# EAGLE design CoaxBoard (EAGLE 9.5.2)
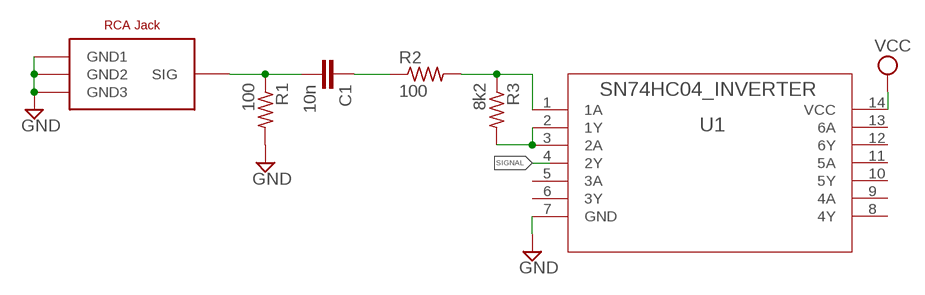
[diagram p0: schematic, sheet 1]

## Parts
C1  10n  C-EUC0805  [C0805]
R1  100  R-US_R0805  [R0805]
R2  100  R-US_R0805  [R0805]
R3  8k2  R-US_R0805  [R0805]
U1  SN74HC04_INVERTER  [NS14]
U$1  RCA_JACK  [RCA_JACK]

## Nets
GND: R1.2 U1.7(GND) U$1.GND1 U$1.GND2 U$1.GND3
N$1: C1.2 R1.1 U$1.SIG
N$2: C1.1 R2.1
N$3: R2.2 R3.1 U1.1(1A)
N$6: R3.2 U1.2(1Y) U1.3(2A)
SIGNAL: U1.4(2Y)
VCC: U1.14(VCC)
Unconnected: U1.5(3A) U1.6(3Y) U1.8(4Y) U1.9(4A) U1.10(5Y) U1.11(5A) U1.12(6Y) U1.13(6A)

## Library data of the parts
C1 = rcl:C-EU: CAPACITOR, European symbol; SPICEPREFIX: C
R1-R3 = resistor:R-US_: RESISTOR, American symbol
U1 = COAX_SPDIF:SN74HC04_INVERTER; DATASHEET_URL: http://www.ti.com/lit/gpn/SN74HC04; DESCRIPTION: Hex Inverters; FAMILY_NAME: INVERTING BUFFER/DRIVER; GENERIC_PART_NUMBER: SN74HC04; INDUSTRY_STD_PKG_TYPE: SO; MANUFACTURER: Texas Instruments; PACKAGE_DESIGNATOR: NS; PIN_COUNT: 14
U$1 = COAX_SPDIF:RCA_JACK

## Net classes
0 default: width 0.508 mm

## Board
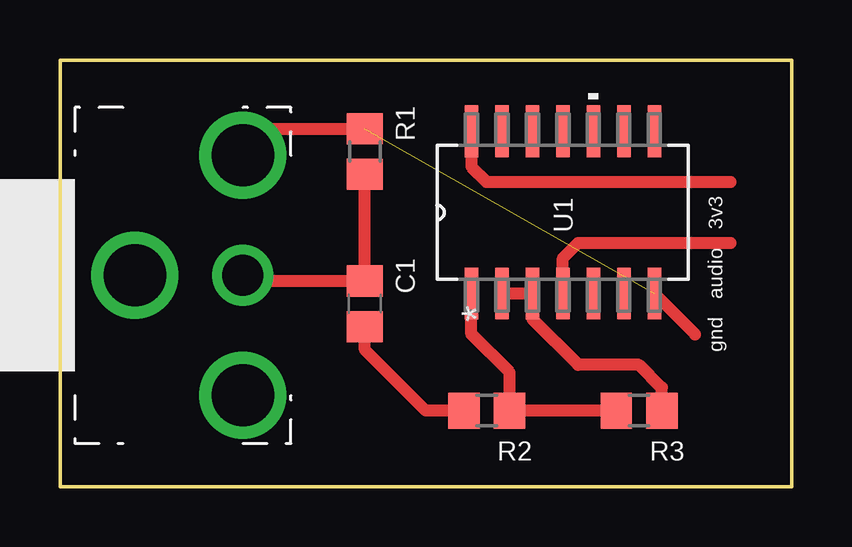
[diagram p1: board, top side]
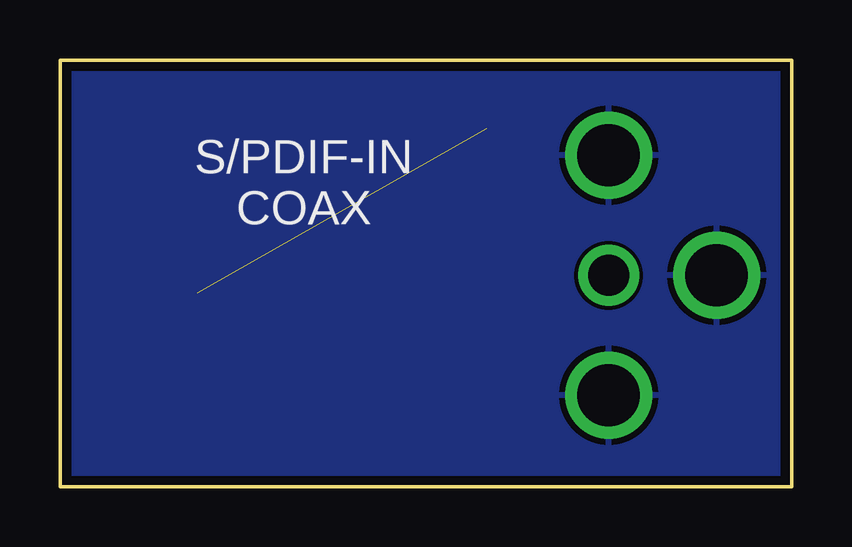
[diagram p2: board, bottom side, seen from below]

Size 30.48 x 17.78 mm. Coordinates in mm from the lower left corner, seen from the top.
Outline: 0,0 0,17.78 30.48,17.78 30.48,0 0,0
Copper layers (1*16): Top 0.035559375mm / dielectric 1.6mm / Bottom 0.035559375mm
Design rules "oshpark-2layer *": minimum track width 6mil, minimum drill 10mil, track to track 6mil, track to pad 6mil, pad to pad 6mil, via to via 6mil, smd to smd 6mil, copper to edge 15mil, drill to drill 6mil, minimum pad ring 5mil, minimum via ring 5mil, stop-mask expansion 2.5mil, vias tented up to drill 20mil, thermal gap 10mil

### Footprints (pad centres in the part's own frame; a part is rotated, then mirrored left to right if it is on the bottom)
C0805 = smd 1.3 x 1.5: 1 -0.95,0; 2 0.95,0
R0805 = smd 1.3 x 1.5: 1 -0.95,0; 2 0.95,0
NS14 = smd 2.159 x 0.559: 1 -3.378,3.81; 2 -3.378,2.54; 3 -3.378,1.27; 4 -3.378,0; 5 -3.378,-1.27; 6 -3.378,-2.54; 7 -3.378,-3.81; 8 3.378,-3.81; 9 3.378,-2.54; 10 3.378,-1.27; 11 3.378,0; 12 3.378,1.27; 13 3.378,2.54; 14 3.378,3.81
RCA_JACK = drill 2.6: GND1 0,0; GND2 5,4.5; GND3 10,0 | drill 1.7: SIG 5,0

### Placement (x,y rotation side)
C1  12.7,7.62 90 top
R1  12.7,13.97 90 top
R2  17.78,3.17 0 top
R3  24.13,3.17 0 top
U1  20.95,11.43 90 top
U$1  7.62,3.81 90 top

### Tracks (layer width: path | path; a pad name or v marks a point on that pad's centre or on a via)
GND  (1 unrouted)
  Top 0.508: U$1.GND3 8.73,14.92 R1.2 | U1.7 26.47,6.35
  pour Bottom: -1.27,24.13 -1.27,-2.54 33.02,-2.54 33.02,24.13
N$1
  Top 0.508: U$1.SIG 7.86,8.57 C1.2 R1.1
N$2
  Top 0.508: R2.1 15.24,3.17 12.7,5.71 C1.1
N$3
  Top 0.508: R3.1 R2.2 18.73,4.76 17.14,6.35 U1.1
N$6
  Top 0.508: U1.2 U1.3 19.68,6.99 21.59,5.08 24.13,5.08 25.08,4.13 R3.2
SIGNAL
  Top 0.508: U1.4 20.95,9.53 21.59,10.16 27.94,10.16
VCC
  Top 0.508: U1.14 17.14,13.34 17.78,12.7 27.94,12.7

### Text on the board
tNames: 3v3 | audio | gnd
bNames: S/PDIF-IN / COAX